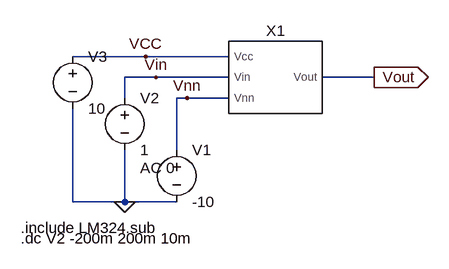
[diagram p0: schematic noninvertCircTBCascade.asc]
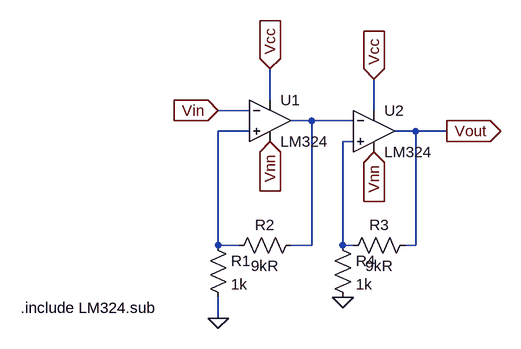
[diagram p1: sub-circuit noninvertcascade.asc]
* noninvertCircTBCascade.asc
V1 Vnn 0 -10
V2 Vin 0 1 AC 0
V3 VCC 0 10
X§X1 VCC Vin Vnn Vout noninvertcascade

* block symbol definitions
.subckt noninvertcascade Vcc Vin Vnn Vout
* U1: LM324 (symbol LM324 not available, pins judged from their places): In+=N002 In-=Vin V+=Vcc V-=Vnn OUT=N001
R1 N002 0 1k
R2 N001 N002 9kR
* U2: LM324 (symbol LM324 not available, pins judged from their places): In+=N003 In-=N001 V+=Vcc V-=Vnn OUT=Vout
R3 Vout N003 9kR
R4 N003 0 1k
.include LM324.sub
.ends noninvertcascade

.dc V2 -200m 200m 10m
.include LM324.sub
.backanno
.end

* Results of the author's LTspice run, read from the files saved beside the schematic
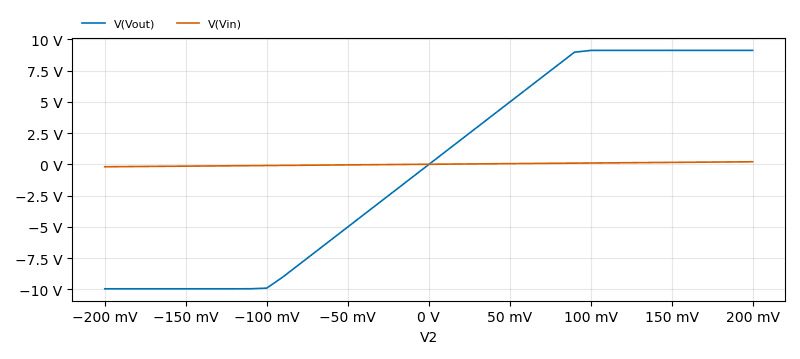
[diagram p2: DC transfer characteristic of noninvertCircTBCascade.asc, plotted from the saved traces]
* DC transfer characteristic, 1 run:
*   V(Vout): -9.963 V at V2=-200 mV, 9.113 V at V2=200 mV, min -9.963 V, max 9.113 V
*   V(Vin): -200 mV at V2=-200 mV, 200 mV at V2=200 mV, min -200 mV, max 200 mV